# EAGLE schematic brush_motor_pcb_v1.1 (EAGLE 8.0.1)
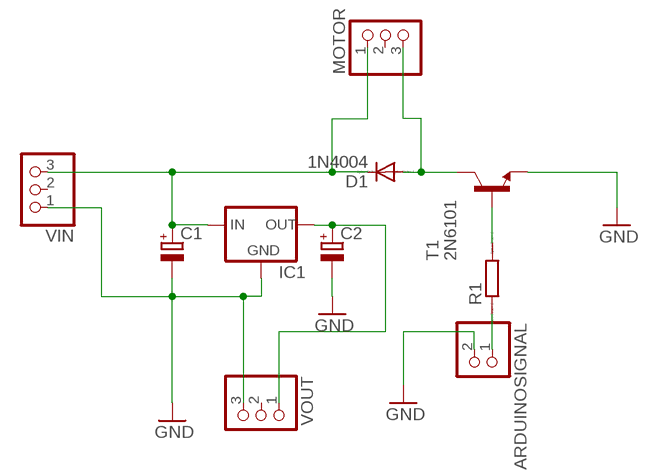
[diagram p0: schematic, sheet 1]

## Parts
ARDUINOSIGNAL  PINHD-1X2  [1X02]
C1  CPOL-EUE2.5-6  [E2,5-6]
C2  CPOL-EUE2.5-6  [E2,5-6]
D1  1N4004  [DO41-10]
IC1  78XXS  [78XXS]
MOTOR  PINHD-1X3  [1X03]
R1  R0207/10  [0207/10]
T1  2N6101  [TO220]
VIN  PINHD-1X3  [1X03]
VOUT  PINHD-1X3  [1X03]

## Nets
GND: ARDUINOSIGNAL.2 C1.- C2.- IC1.GND T1.3(E) VIN.1 VOUT.3
N$1: ARDUINOSIGNAL.1 R1.1
N$2: R1.2 T1.1(B)
N$3: D1.A MOTOR.3 T1.2(C)
N$4: C1.+ D1.C IC1.IN MOTOR.1 VIN.3
N$5: C2.+ IC1.OUT VOUT.1
Unconnected: MOTOR.2 VIN.2 VOUT.2

## Library data of the parts
ARDUINOSIGNAL = pinhead:PINHD-1X2: PIN HEADER
C1 C2 = rcl:CPOL-EU: POLARIZED CAPACITOR, European symbol
D1 = diode:1N4004: DIODE general purpose rectifier, 1 A
IC1 = v-reg:78XXS: VOLTAGE REGULATOR
MOTOR VIN VOUT = pinhead:PINHD-1X3: PIN HEADER
R1 = eagle-ltspice:R: RESISTOR, European symbol; SPICEMODEL: NONE; SPICEPREFIX: R
T1 = transistor:2N6101: NPN TRANSISTOR